# EAGLE design working (EAGLE 9.6.2)
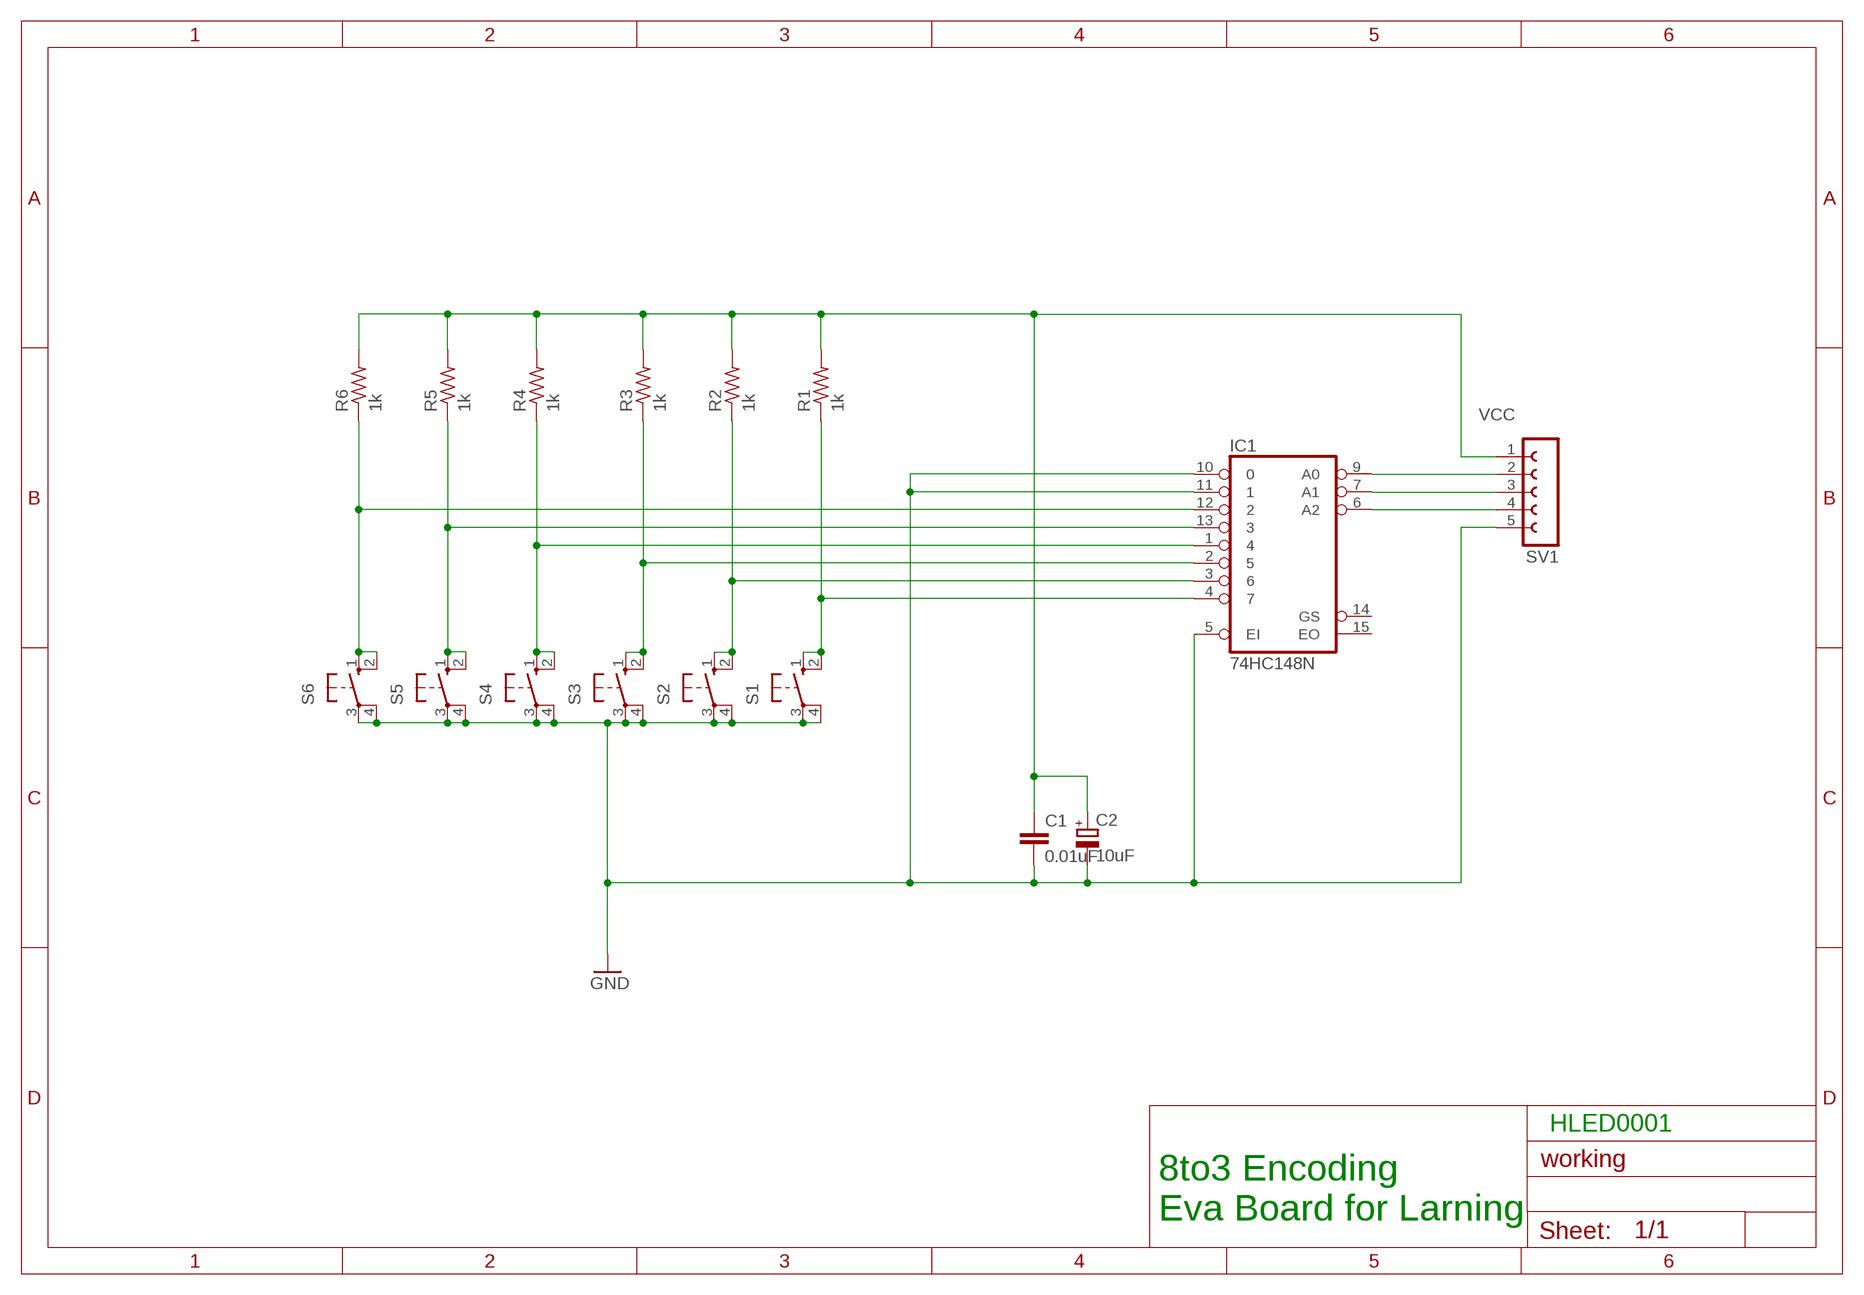
[diagram p0: schematic, sheet 1]

## Parts
C1  0.01uF  C-EU025-025X050  [C025-025X050]
C2  10uF  CPOL-EUE2,5-6E  [E2,5-6E]
IC1  74HC148N  [DIL16]
R1  1k  R-US_0207/7  [0207/7]
R2  1k  R-US_0207/7  [0207/7]
R3  1k  R-US_0207/7  [0207/7]
R4  1k  R-US_0207/7  [0207/7]
R5  1k  R-US_0207/7  [0207/7]
R6  1k  R-US_0207/7  [0207/7]
S1  10-XX  [B3F-10XX]
S2  10-XX  [B3F-10XX]
S3  10-XX  [B3F-10XX]
S4  10-XX  [B3F-10XX]
S5  10-XX  [B3F-10XX]
S6  10-XX  [B3F-10XX]
SV1  FE05-1  [FE05-1]

## Nets
GND: C1.2 C2.- IC1.5(EI) IC1.10 IC1.11 S1.3(P) S1.4(P1) S2.3(P) S2.4(P1) S3.3(P) S3.4(P1) S4.3(P) S4.4(P1) S5.3(P) S5.4(P1) S6.3(P) S6.4(P1) SV1.5
N$2: IC1.4 R1.1 S1.1(S) S1.2(S1)
N$3: IC1.3 R2.1 S2.1(S) S2.2(S1)
N$4: IC1.2 R3.1 S3.1(S) S3.2(S1)
N$5: IC1.1 R4.1 S4.1(S) S4.2(S1)
N$6: IC1.13 R5.1 S5.1(S) S5.2(S1)
N$7: IC1.12 R6.1 S6.1(S) S6.2(S1)
N$8: IC1.9(A0) SV1.2
N$9: IC1.7(A1) SV1.3
N$10: IC1.6(A2) SV1.4
VCC: C1.1 C2.+ R1.2 R2.2 R3.2 R4.2 R5.2 R6.2 SV1.1
Unconnected: IC1.14(GS) IC1.15(EO)

## Notes on the sheet
- HLED0001
- 8to3 Encoding 
  Eva Board for Larning

## Power pins joined to a net without a drawn wire
GND: IC1.8(GND)
VCC: IC1.16(VCC)

## Library data of the parts
C1 = rcl:C-EU: CAPACITOR, European symbol; SPICEPREFIX: C
C2 = rcl:CPOL-EU: POLARIZED CAPACITOR, European symbol; SPICEPREFIX: C
IC1 = 74xx-eu:74*148: 10-line to 4-line and 8-line to 3-line PRIORITY ENCODER
R1-R6 = rcl:R-US_: RESISTOR, American symbol; SPICEPREFIX: R
S1-S6 = switch-omron:10-XX: OMRON SWITCH
SV1 = con-lsta:FE05-1: FEMALE HEADER; OC_FARNELL: unknown; OC_NEWARK: unknown

## Board
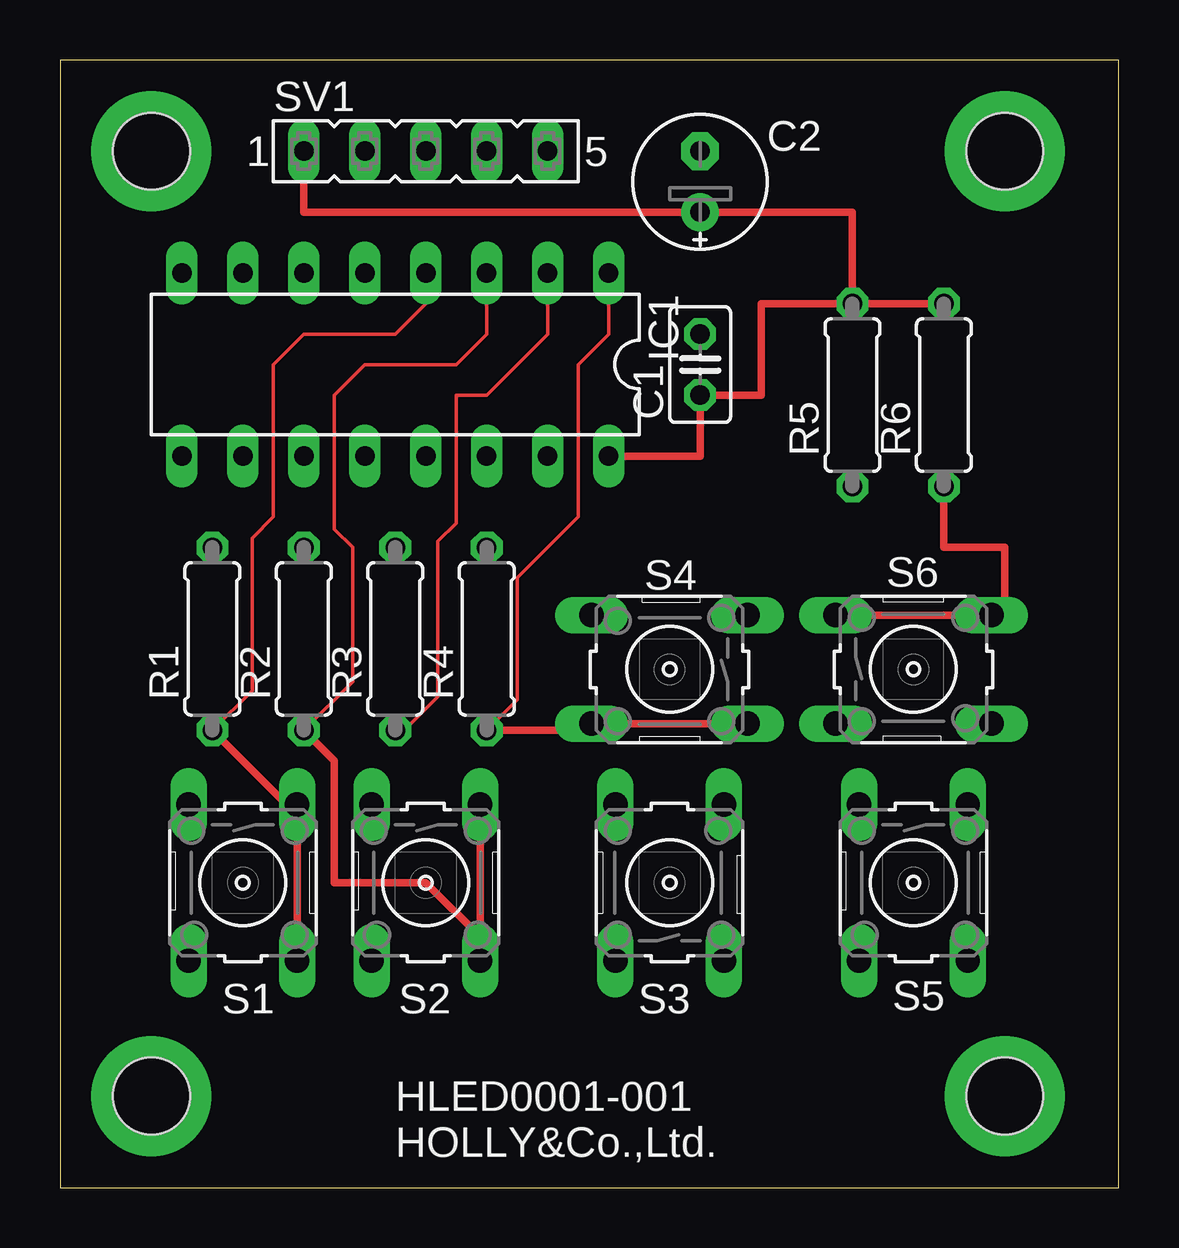
[diagram p1: board, top side]
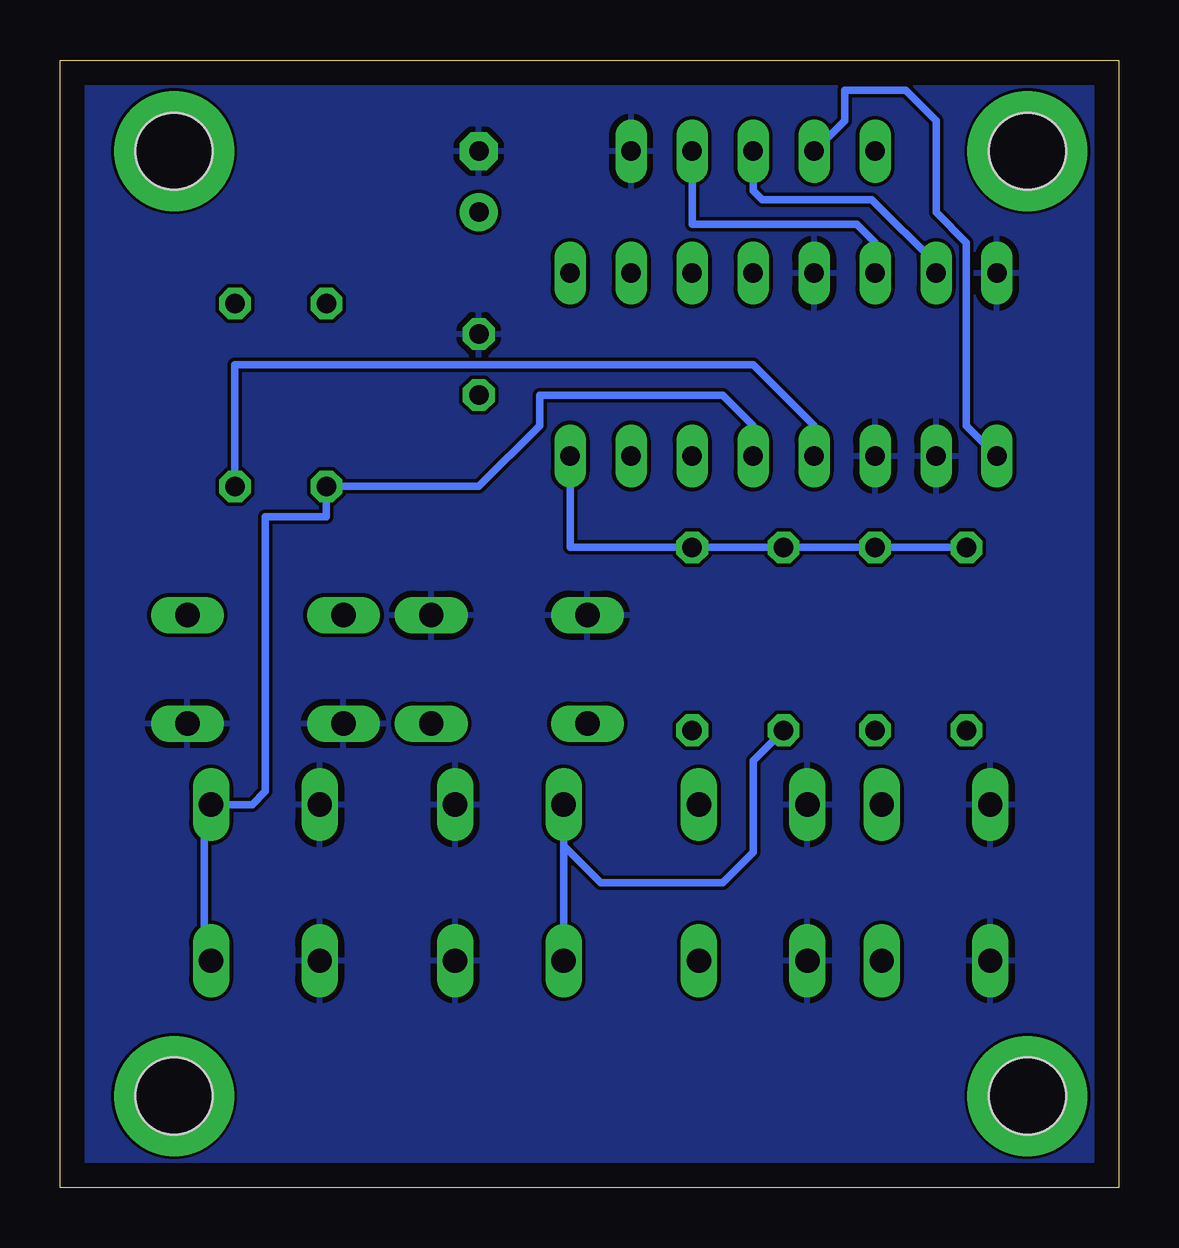
[diagram p2: board, bottom side, seen from below]

Size 44.12 x 46.98 mm. Coordinates in mm from the lower left corner, seen from the top.
Outline: 0,0 44.12,0 44.12,46.98 0,46.98 0,0
Copper layers (1*16): Top 0.035mm / dielectric 1.5mm / Bottom 0.035mm
Design rules "default": minimum track width 6mil, minimum drill 0.35mm, track to track 6mil, track to pad 6mil, pad to pad 6mil, via to via 6mil, smd to smd 6mil, copper to edge 40mil, drill to drill 6mil, minimum pad ring 10mil, minimum via ring 8mil, stop-mask expansion 4mil, vias tented up to drill 0mil, thermal gap 10mil
Holes 3.2 mm at 3.81,43.18 3.81,3.81 39.37,3.81 39.37,43.18

### Footprints (pad centres in the part's own frame; a part is rotated, then mirrored left to right if it is on the bottom)
C025-025X050 = drill 0.813 octagon: 1 -1.27,0; 2 1.27,0
E2,5-6E = drill 0.813 pad 1.575: + -1.27,0 | drill 0.813 pad 1.575 octagon: - 1.27,0
DIL16 = drill 0.813 long: 1 -8.89,-3.81; 2 -6.35,-3.81; 3 -3.81,-3.81; 4 -1.27,-3.81; 5 1.27,-3.81; 6 3.81,-3.81; 7 6.35,-3.81; 8 8.89,-3.81; 9 8.89,3.81; 10 6.35,3.81; 11 3.81,3.81; 12 1.27,3.81; 13 -1.27,3.81; 14 -3.81,3.81; 15 -6.35,3.81; 16 -8.89,3.81
0207/7 = drill 0.813 octagon: 1 -3.81,0; 2 3.81,0
B3F-10XX = drill 1.016 long: 1 -3.251,2.261; 2 3.251,2.261; 3 -3.251,-2.261; 4 3.251,-2.261
FE05-1 = drill 0.813 long: 1 -5.08,0; 2 -2.54,0; 3 0,0; 4 2.54,0; 5 5.08,0

### Placement (x,y rotation side)
C1  26.67,34.29 90 top
C2  26.67,41.91 90 top
IC1  13.97,34.29 180 top
R1  6.35,22.86 90 top
R2  10.16,22.86 90 top
R3  13.97,22.86 90 top
R4  17.78,22.86 90 top
R5  33.02,33.02 90 top
R6  36.83,33.02 90 top
S1  7.62,12.7 270 top
S2  15.24,12.7 270 top
S3  25.4,12.7 90 top
S4  25.4,21.59 180 top
S5  35.56,12.7 270 top
S6  35.56,21.59 0 top
SV1  15.24,43.18 0 top

### Tracks (layer width: path | path; a pad name or v marks a point on that pad's centre or on a via)
GND  (via drill 3.2 pad 5)
  other vias: 3.81,43.18 39.37,43.18 39.37,3.81 3.81,3.81 39.37,43.18
  pour Bottom: 0,46.99 44.45,46.99 44.45,0 0,0
N$2
  Top 0.152: IC1.4 15.24,36.83 13.97,35.56 10.16,35.56 8.89,34.29 8.89,27.94 8,27.05 8,20.7 R1.1
  Top 0.305: R1.1 9.45,15.95 S1.1 S1.2
N$3
  Top 0.152: IC1.3 17.78,35.56 16.51,34.29 12.7,34.29 11.43,33.02 11.43,27.43 12.19,26.67 12.19,21.08 R2.1
  Top 0.305: R2.1 11.43,17.78 11.43,12.7 15.24,12.7 17.5,10.44 S2.2 S2.1
N$4
  Top 0.152: IC1.2 20.32,35.56 17.78,33.02 16.51,33.02 16.51,27.69 15.75,26.92 15.75,20.45 14.35,19.05 R3.1
  Bottom 0.305: R3.1 15.24,17.78 15.24,13.97 16.51,12.7 21.59,12.7 23.14,14.25 S3.2 S3.1
N$5
  Top 0.152: IC1.1 22.86,35.56 21.59,34.29 21.59,27.94 19.05,25.4 19.05,20.32 R4.1
  Top 0.305: R4.1 21.87,19.05 S4.2 S4.1
N$6
  Bottom 0.305: S5.2 38.1,9.73 38.1,15.67 S5.1 36.12,15.95 35.56,16.51 35.56,27.94 33.02,27.94 R5.1 26.67,29.21 24.13,31.75 24.13,33.02 16.51,33.02 15.24,31.75 IC1.13
N$7
  Top 0.305: R6.1 36.83,26.67 39.37,26.67 39.37,24.41 S6.2 S6.1
  Bottom 0.305: R6.1 36.83,34.29 15.24,34.29 12.7,31.75 IC1.12
N$8
  Bottom 0.305: SV1.2 11.43,44.45 11.43,45.72 8.89,45.72 7.62,44.45 7.62,40.64 6.35,39.37 6.35,31.75 IC1.9
N$9
  Bottom 0.305: SV1.3 15.24,41.53 14.86,41.15 10.29,41.15 7.62,38.48 IC1.7
N$10
  Bottom 0.305: SV1.4 17.78,40.13 10.92,40.13 10.16,39.37 IC1.6
VCC
  Top 0.305: R5.2 33.02,40.64 C2.+ 10.16,40.64 SV1.1 | R5.2 R6.2 | R5.2 29.21,36.83 29.21,33.02 C1.1 26.67,30.48 IC1.16
  Bottom 0.305: IC1.16 22.86,26.67 R4.2 R3.2 R2.2 R1.2

### Text on the board
tNames: HLED0001-001 / HOLLY&Co.,Ltd.